# Altium schematic sheet LCD.SchDoc: LCD
size B; Date: 24-02-04; CheckedBy: Jude Thibeault; Author: Kyle Dick; Engineer: Kyle Dick; Revision: 1; SheetNumber: 3; SheetTotal: 9
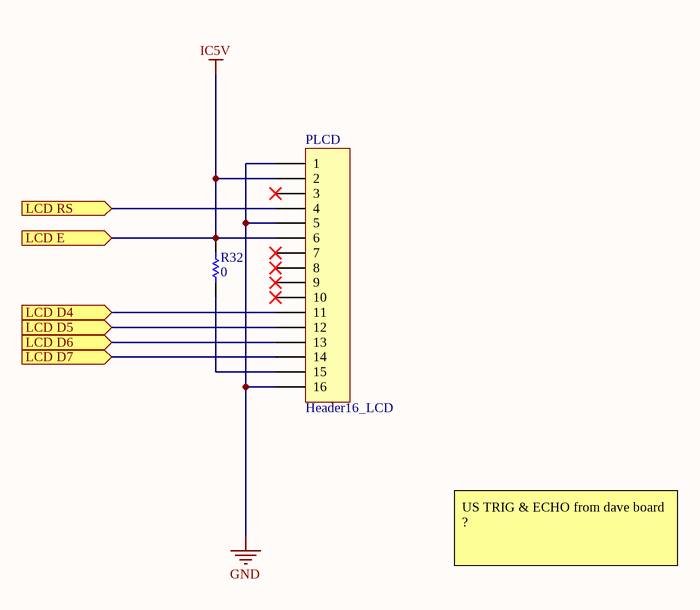
[diagram p0: LCD.SchDoc]

## Parts
PLCD  Header16_LCD  [HDR1X16_LCD]
R32  value 0  (hidden comment: Resistor)

## Ports
LCD D4 (in, see Top Level Hierarchy[4C], MCU Header[4C]), LCD D5 (in, see Top Level Hierarchy[4C], MCU Header[4C]), LCD D6 (in, see Top Level Hierarchy[4C], MCU Header[4C]), LCD D7 (in, see Top Level Hierarchy[4C], MCU Header[5C]), LCD E (in, see Top Level Hierarchy[4C], MCU Header[4C]), LCD RS (in, see Top Level Hierarchy[4C], MCU Header[4C])

## Nets
GND: PLCD.1 PLCD.5 PLCD.16
IC5V: PLCD.2 PLCD.6 R32.1 ; port LCD E
LCD D4: PLCD.11 ; port LCD D4
LCD D5: PLCD.12 ; port LCD D5
LCD D6: PLCD.13 ; port LCD D6
LCD D7: PLCD.14 ; port LCD D7
LCD RS: PLCD.4 ; port LCD RS
NetPLCD_15: PLCD.15 R32.2

Not connected (* = marked no-connect by the designer): PLCD 3* 7* 8* 9* 10*

## Notes on the sheet
- US TRIG & ECHO from dave board ?
- ESE
- is the sole property of ESE. Any reproduction
- The Information Contained in this drawing
- Schematic P/N and Name
- Sheet Name
- 850 Fountain St. S.
- Cambridge, ON N3H 0A8
- Canada
- Approved
- in part or in whole without the written
- permission of ESE is strictly prohibited.
- APPROVALS
- DATE
- Size
- Scale
- B
- NTS
- Bare PCB P/N
- Date
- Sheet
- Rev.
- Checked
- Created
- of

## Library data of the parts
PLCD = Header16_LCD: Header, 16-Pin Female; MPN: PPPC161LFBN-RC; PN: S7049-ND; URL: http://www.digikey.ca/product-detail/en/PPPC161LFBN-RC/S7049-ND
R32 = Resistor: SimulationGenericComponent: True; TC1: 0; TC2: 0